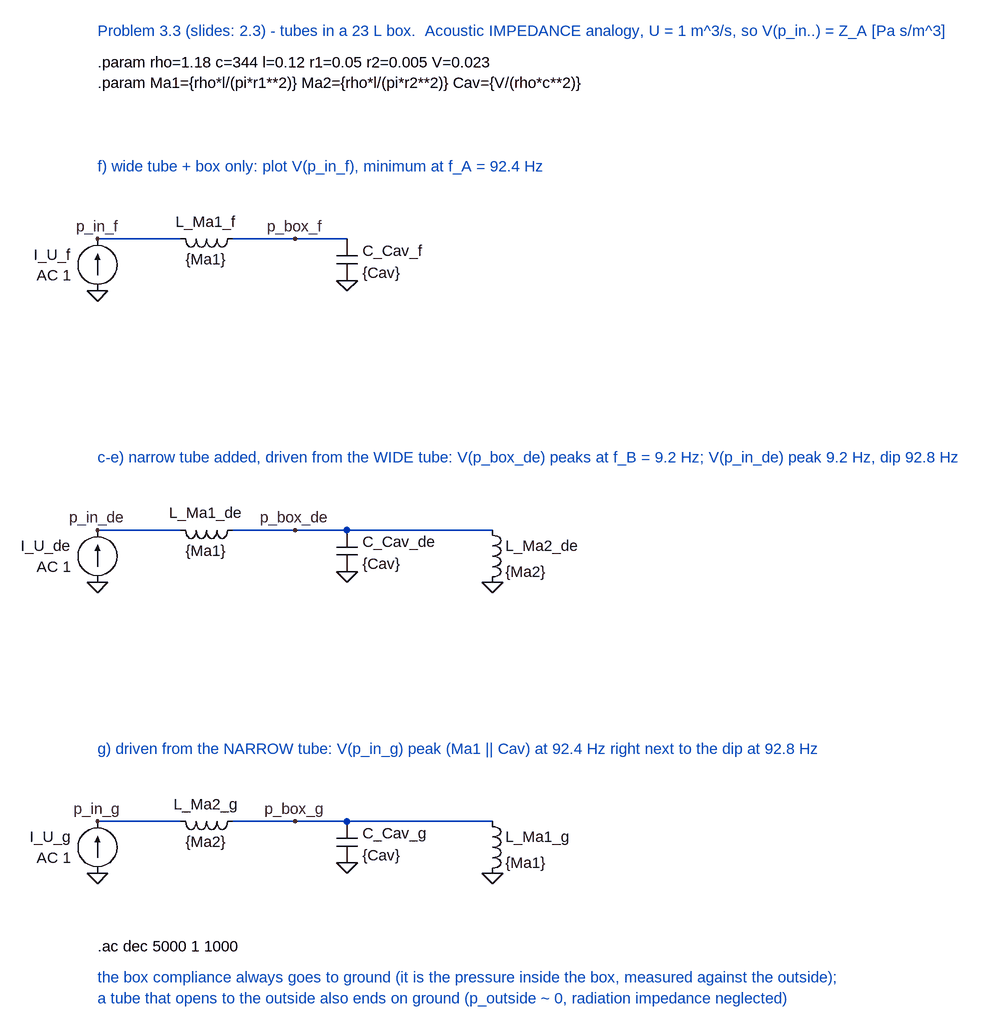
[diagram p0: schematic P3-3_Tubes_in_Box.asc]
P3-3_Tubes_in_Box.asc, the LTspice schematic file:
Version 4
SHEET 1 3000 1600
WIRE 0 0 128 0
WIRE 208 0 384 0
WIRE 0 448 128 448
WIRE 208 448 608 448
WIRE 0 896 128 896
WIRE 208 896 608 896
FLAG 0 80 0
FLAG 0 0 p_in_f
FLAG 304 0 p_box_f
FLAG 384 64 0
FLAG 0 528 0
FLAG 0 448 p_in_de
FLAG 304 448 p_box_de
FLAG 384 512 0
FLAG 608 528 0
FLAG 0 976 0
FLAG 0 896 p_in_g
FLAG 304 896 p_box_g
FLAG 384 960 0
FLAG 608 976 0
SYMBOL current 0 80 R180
WINDOW 0 40 56 Left 2
WINDOW 3 40 24 Left 2
SYMATTR InstName I_U_f
SYMATTR Value AC 1
SYMBOL ind 224 -16 R90
WINDOW 0 5 56 VBottom 2
WINDOW 3 32 56 VTop 2
SYMATTR InstName L_Ma1_f
SYMATTR Value {Ma1}
SYMATTR SpiceLine Rser=0
SYMBOL cap 368 0 R0
WINDOW 0 40 18 Left 2
WINDOW 3 40 52 Left 2
SYMATTR InstName C_Cav_f
SYMATTR Value {Cav}
SYMBOL current 0 528 R180
WINDOW 0 40 56 Left 2
WINDOW 3 40 24 Left 2
SYMATTR InstName I_U_de
SYMATTR Value AC 1
SYMBOL ind 224 432 R90
WINDOW 0 5 56 VBottom 2
WINDOW 3 32 56 VTop 2
SYMATTR InstName L_Ma1_de
SYMATTR Value {Ma1}
SYMATTR SpiceLine Rser=0
SYMBOL cap 368 448 R0
WINDOW 0 40 18 Left 2
WINDOW 3 40 52 Left 2
SYMATTR InstName C_Cav_de
SYMATTR Value {Cav}
SYMBOL ind 592 432 R0
SYMATTR InstName L_Ma2_de
SYMATTR Value {Ma2}
SYMATTR SpiceLine Rser=0
SYMBOL current 0 976 R180
WINDOW 0 40 56 Left 2
WINDOW 3 40 24 Left 2
SYMATTR InstName I_U_g
SYMATTR Value AC 1
SYMBOL ind 224 880 R90
WINDOW 0 5 56 VBottom 2
WINDOW 3 32 56 VTop 2
SYMATTR InstName L_Ma2_g
SYMATTR Value {Ma2}
SYMATTR SpiceLine Rser=0
SYMBOL cap 368 896 R0
WINDOW 0 40 18 Left 2
WINDOW 3 40 52 Left 2
SYMATTR InstName C_Cav_g
SYMATTR Value {Cav}
SYMBOL ind 592 880 R0
SYMATTR InstName L_Ma1_g
SYMATTR Value {Ma1}
SYMATTR SpiceLine Rser=0
TEXT 0 -320 Left 2 ;Problem 3.3 (slides: 2.3) - tubes in a 23 L box.  Acoustic IMPEDANCE analogy, U = 1 m^3/s, so V(p_in..) = Z_A [Pa s/m^3]
TEXT 0 -272 Left 2 !.param rho=1.18 c=344 l=0.12 r1=0.05 r2=0.005 V=0.023
TEXT 0 -240 Left 2 !.param Ma1={rho*l/(pi*r1**2)} Ma2={rho*l/(pi*r2**2)} Cav={V/(rho*c**2)}
TEXT 0 -112 Left 2 ;f) wide tube + box only: plot V(p_in_f), minimum at f_A = 92.4 Hz
TEXT 0 336 Left 2 ;c-e) narrow tube added, driven from the WIDE tube: V(p_box_de) peaks at f_B = 9.2 Hz; V(p_in_de) peak 9.2 Hz, dip 92.8 Hz
TEXT 0 784 Left 2 ;g) driven from the NARROW tube: V(p_in_g) peak (Ma1 || Cav) at 92.4 Hz right next to the dip at 92.8 Hz
TEXT 0 1088 Left 2 !.ac dec 5000 1 1000
TEXT 0 1136 Left 2 ;the box compliance always goes to ground (it is the pressure inside the box, measured against the outside);
TEXT 0 1168 Left 2 ;a tube that opens to the outside also ends on ground (p_outside ~ 0, radiation impedance neglected)

The netlist it stands for:
* P3-3_Tubes_in_Box.asc
I_U_f 0 p_in_f AC 1
L_Ma1_f p_box_f p_in_f {Ma1} Rser=0
C_Cav_f p_box_f 0 {Cav}
I_U_de 0 p_in_de AC 1
L_Ma1_de p_box_de p_in_de {Ma1} Rser=0
C_Cav_de p_box_de 0 {Cav}
L_Ma2_de p_box_de 0 {Ma2} Rser=0
I_U_g 0 p_in_g AC 1
L_Ma2_g p_box_g p_in_g {Ma2} Rser=0
C_Cav_g p_box_g 0 {Cav}
L_Ma1_g p_box_g 0 {Ma1} Rser=0
* Problem 3.3 (slides: 2.3) - tubes in a 23 L box.  Acoustic IMPEDANCE analogy, U = 1 m^3/s, so V(p_in..) = Z_A [Pa s/m^3]
.param rho=1.18 c=344 l=0.12 r1=0.05 r2=0.005 V=0.023
.param Ma1={rho*l/(pi*r1**2)} Ma2={rho*l/(pi*r2**2)} Cav={V/(rho*c**2)}
* f) wide tube + box only: plot V(p_in_f), minimum at f_A = 92.4 Hz
* c-e) narrow tube added, driven from the WIDE tube: V(p_box_de) peaks at f_B = 9.2 Hz; V(p_in_de) peak 9.2 Hz, dip 92.8 Hz
* g) driven from the NARROW tube: V(p_in_g) peak (Ma1 || Cav) at 92.4 Hz right next to the dip at 92.8 Hz
.ac dec 5000 1 1000
* the box compliance always goes to ground (it is the pressure inside the box, measured against the outside);
* a tube that opens to the outside also ends on ground (p_outside ~ 0, radiation impedance neglected)
.backanno
.end